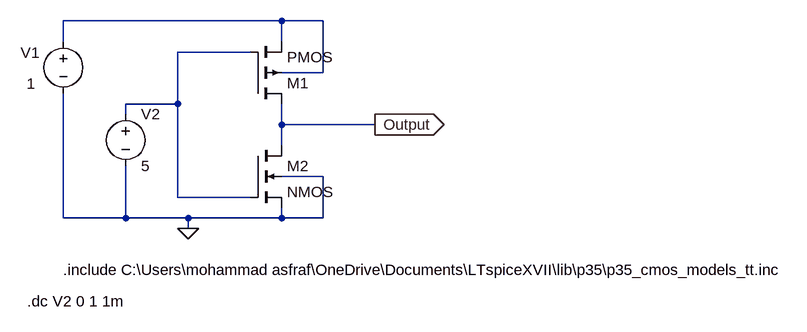
[diagram p0: schematic CMOS_Inv_DC.asc]
CMOS_Inv_DC.asc, the LTspice schematic file:
Version 4
SHEET 1 1484 1368
WIRE 224 96 -112 96
WIRE 288 96 224 96
WIRE -112 128 -112 96
WIRE 224 128 224 96
WIRE 176 144 64 144
WIRE 288 176 288 96
WIRE 288 176 224 176
WIRE 64 224 64 144
WIRE 64 224 -16 224
WIRE -16 240 -16 224
WIRE 224 256 224 224
WIRE 368 256 224 256
WIRE 224 288 224 256
WIRE 288 336 224 336
WIRE 64 368 64 224
WIRE 176 368 64 368
WIRE -112 400 -112 208
WIRE -16 400 -16 320
WIRE -16 400 -112 400
WIRE 80 400 -16 400
WIRE 224 400 224 384
WIRE 224 400 80 400
WIRE 288 400 288 336
WIRE 288 400 224 400
WIRE 80 416 80 400
FLAG 80 416 0
FLAG 368 256 Output
IOPIN 368 256 Out
SYMBOL voltage -112 112 R0
WINDOW 0 -51 49 Bottom 2
WINDOW 3 -50 65 Top 2
WINDOW 123 0 0 Left 0
WINDOW 39 0 0 Left 0
SYMATTR InstName V1
SYMATTR Value 1
SYMBOL voltage -16 224 R0
WINDOW 123 0 0 Left 0
WINDOW 39 0 0 Left 0
SYMATTR InstName V2
SYMATTR Value 5
SYMBOL pmos4 176 224 M180
SYMATTR InstName M1
SYMATTR Value2 l=350n w=8u
SYMBOL nmos4 176 288 R0
SYMATTR InstName M2
SYMATTR Value2 l=350n w=4u
TEXT -112 480 Left 2 !.include C:\\Users\\mohammad asfraf\\OneDrive\\Documents\\LTspiceXVII\\lib\\p35\\p35_cmos_models_tt.inc
TEXT -168 528 Left 2 !.dc V2 0 1 1m

The netlist it stands for:
* CMOS_Inv_DC.asc
V1 N001 0 1
V2 N002 0 5
M1 Output N002 N001 N001 PMOS l=350n w=8u
M2 Output N002 0 0 NMOS l=350n w=4u
.model NMOS NMOS
.model PMOS PMOS
.lib standard.mos
.include C:\Users\mohammad asfraf\OneDrive\Documents\LTspiceXVII\lib\p35\p35_cmos_models_tt.inc
.dc V2 0 1 1m
.backanno
.end